# Altium schematic sheet Power.SchDoc
size 254 x 127 mm; SheetNumber: 1; SheetTotal: 3
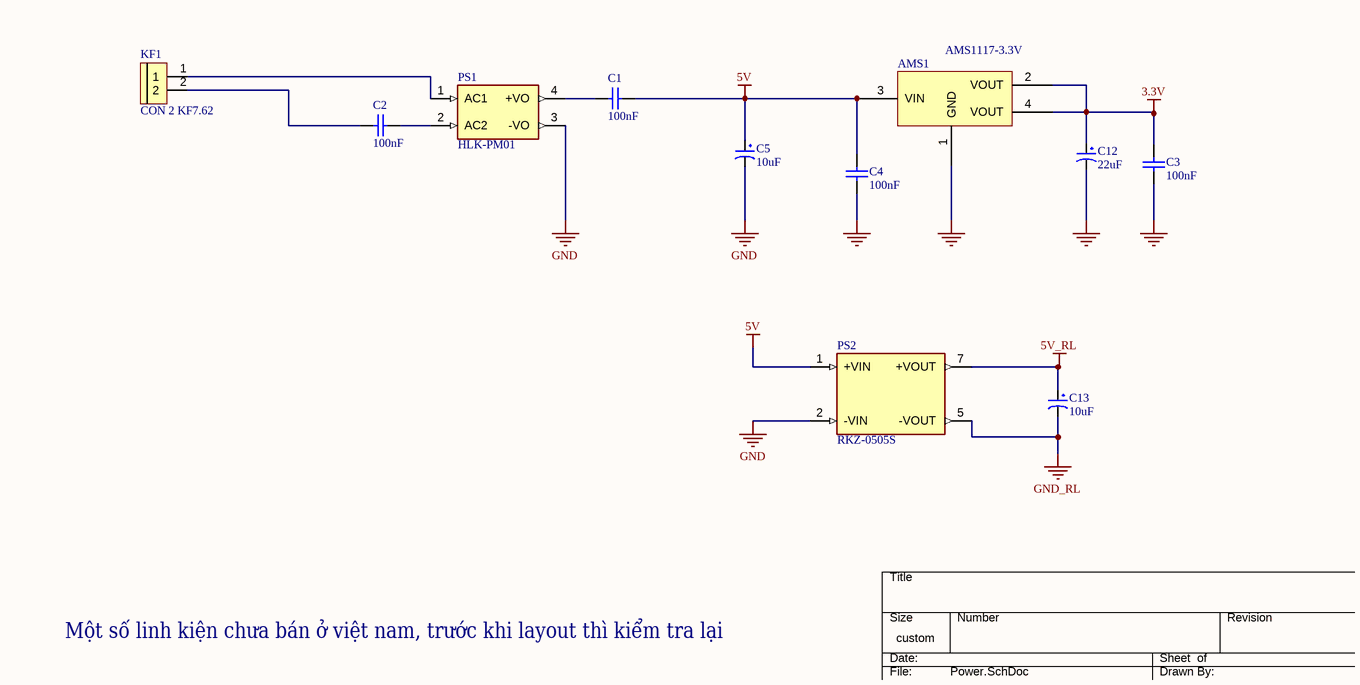
[diagram p0: Power.SchDoc]

## Parts
AMS1  AMS1117-3.3V  [SOT223]
C1  100nF  [tu gom]
C2  100nF  [tu gom]
C3  100nF  [tu gom]
C4  100nF  [tu gom]
C5  10uF  [tu hoa 5mm]
C12  22uF  [tu hoa 5mm]
C13  10uF  [tu hoa 5mm]
KF1  CON 2 KF7.62  [CON 2 KF7.62]
PS1  HLK-PM01  [CONV_HLK-PM01]
PS2  RKZ-0505S  [CONV_RKZ-0505S]

## Nets
3.3V: AMS1.2(VOUT) AMS1.4(VOUT) C3.1 C12.1
5V: AMS1.3(VIN) C1.2 C4.1 C5.1 PS2.1(+VIN)
5V_RL: C13.1 PS2.7(+VOUT)
GND: AMS1.1(GND) C3.2 C4.2 C5.2 C12.2 PS1.3(-VO) PS2.2(-VIN)
GND_RL: C13.2 PS2.5(-VOUT)
NetC1_1: C1.1 PS1.4(+VO)
NetC2_1: C2.1 KF1.2
NetC2_2: C2.2 PS1.2(AC2)
NetKF1_1: KF1.1 PS1.1(AC1)

## Notes on the sheet
- Một số linh kiện chưa bán ở việt nam, trước khi layout thì kiểm tra lại
- DWG. NO.
- REV.
- SHT.
- THIS DOCUMENT AND THE DATA DISCLOSED HEREIN OR HEREWITH IS THE PROPERTY OF ALTIUM LIMITED AND MAY BE FREELY DISTRIBUTED IN WHOLE. NO RIGHTS ARE RESERVED OR EXPRESS OR IMPLIED WARANTEE GIVEN.
- REVISION
- DESCRIPTION
- DATE
- APPROVED
- ENG:
- APPROVALS
- PROJECT
- DSN:
- CHK:
- REFERENCE DOCUMENTS
- PROJECT REVISION:
- TITLE
- DOCUMENT REVISION:
- DESIGN ITEM:
- BOM:
- FAB DWG:
- PCB DWG:
- ASSY DWG:
- SCALE:
- SIZE
- B
- CAGE CODE
- FILE NAME
- DWG NO.
- SHEET
- OF
- REV

## Library data of the parts
AMS1 = AMS1117 SMD: Dán; Value: AMS1117-3.3V SOT223; Don_Vi: Con; Ma_Hang: MH000596; Ghi_Chu: *; Kieu_Chan: *; Chung_Loai: Dán
C1-C4 = Tu gom 15pF 50V: Cắm; Don_Vi: Con; So_Chan: 2; Ten_Linh_Kien: Tụ gốm 15P 50V; Ma_Hang: MH004767; Chung_Loai: Cắm; Kieu_Chan: *
C5 C12 C13 = Tu Hoa 0.1uF 50V 5x11: Cắm; Don_Vi: Con; So_Chan: 2; Ten_Linh_Kien: Tụ Hóa 0.1uF 50V; Ma_Hang: MH006853; Chung_Loai: Cắm; Kieu_Chan: *
KF1 = CON 2 KF7.62: Cắm; Ma_Hang: MH002053; Ten_Linh_Kien: CON 2 KF7.62-2P 7.62MM (Đen Thẳng); Chung_Loai: Cắm; Ghi_Chu: *; Kieu_Chan: *; Don_Vi: Con
PS1 = HLK-PM01: The HLK-PM01 is a small size low cost AC to DC converter which can take in 110V/220V AC at 50/60 Hz and give 5V 3W output. The module is can be used in designs which run on 5V and needs to be powered form the AC mains.; MF: Hi-link; SnapEDA_Link: https://www.snapeda.com/parts/hlk-pm01/Hi-link/view-part/?ref=snap; Package: None; Value: *; MP: hlk-pm01; Check_prices: https://www.snapeda.com/parts/hlk-pm01/Hi-link/view-part/?ref=eda
PS2 = RKZ-0505S: RKZ Series 2 W Single Output 5 V DC/DC Converter - SIP-7; Package: None; Price: None; Value: *; MP: RKZ-0505S; Availability: Unavailable